# EAGLE schematic AGSE_Motor_Controller (EAGLE 6.5.0)
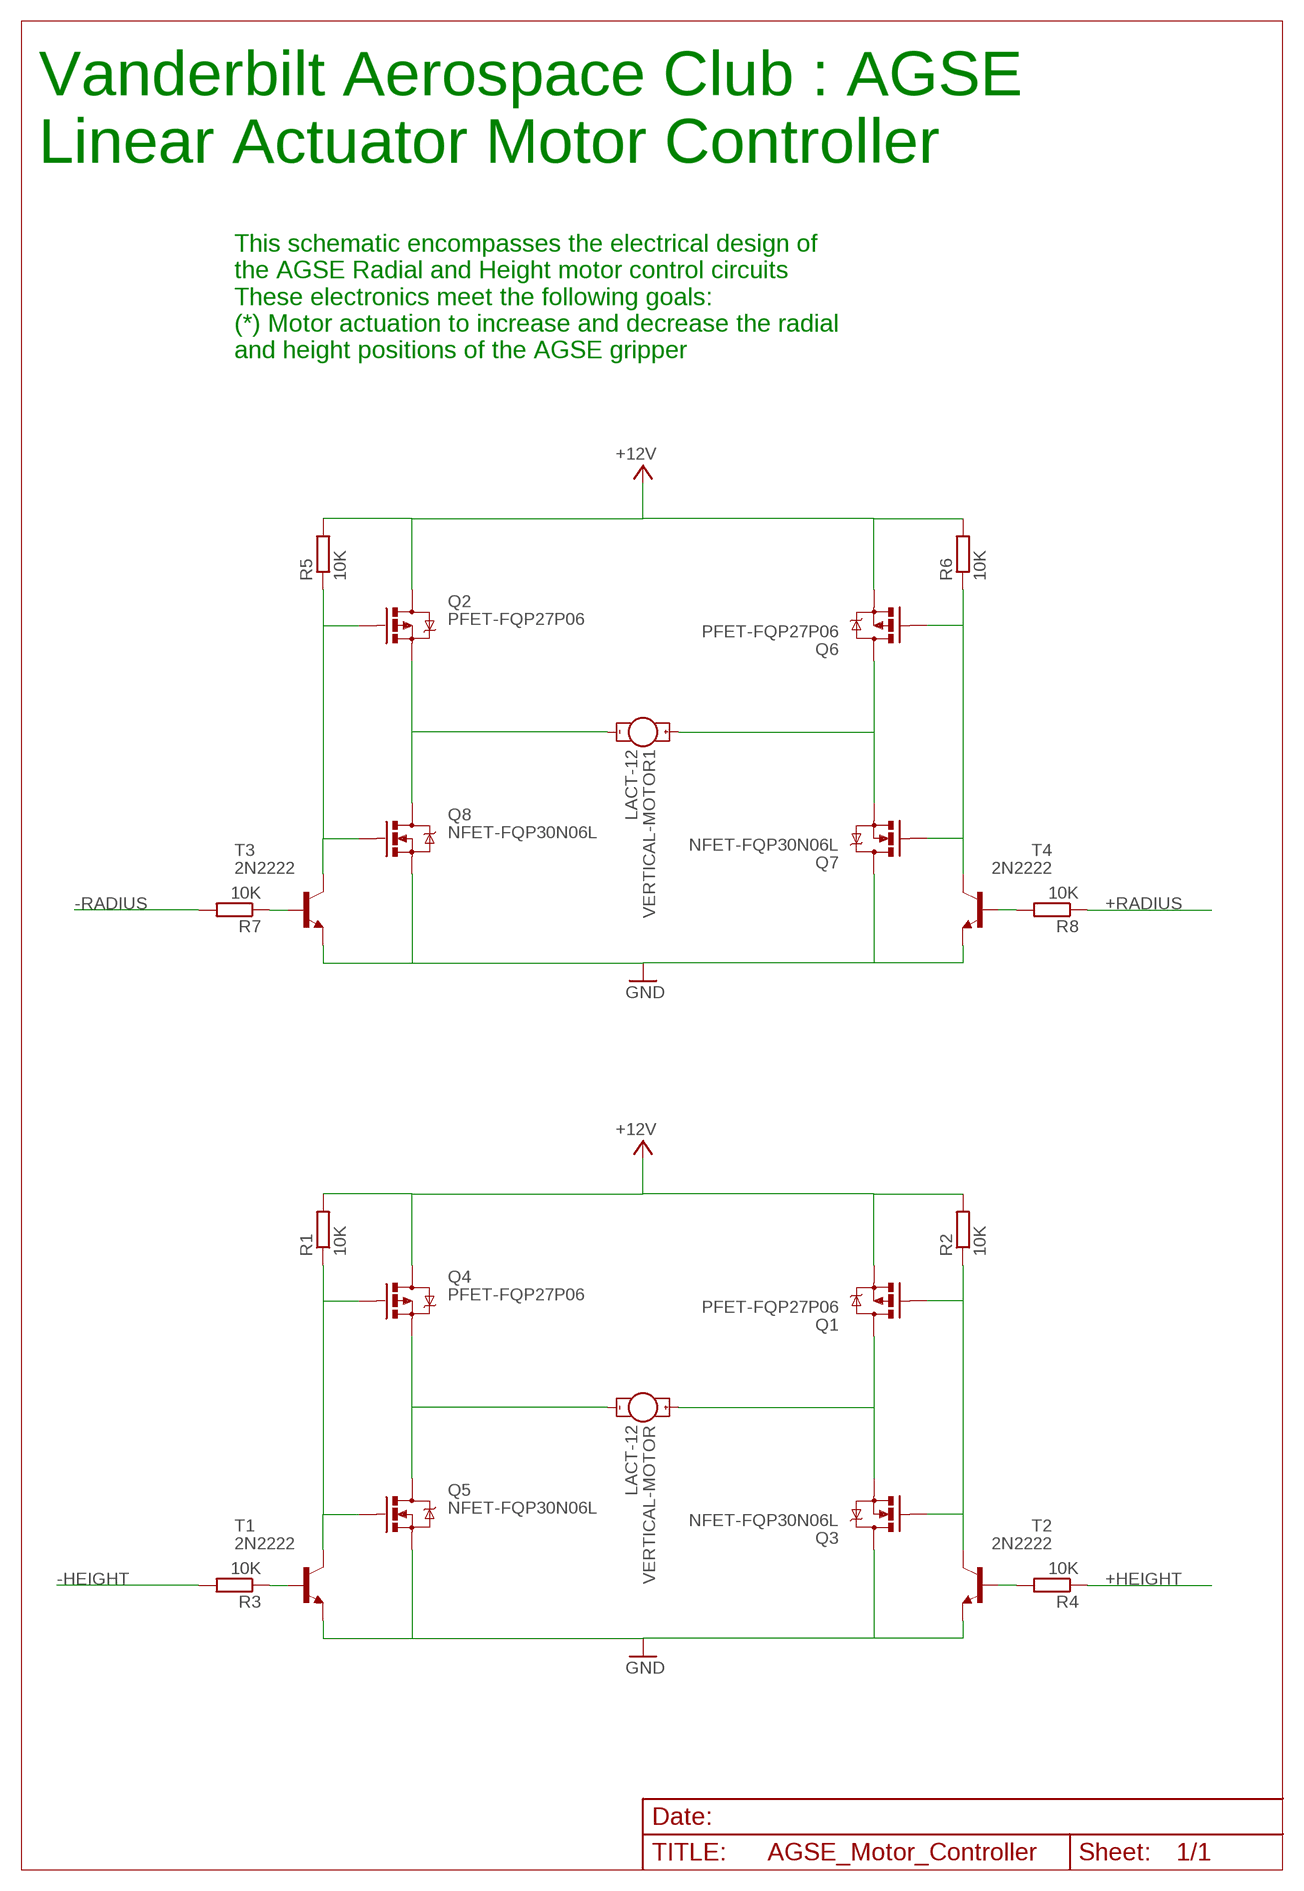
[diagram p0: schematic, sheet 1]

## Parts
Q1  PFET-FQP27P06  MOSFET-PCHANNELFQP27P06  [TO220V]
Q2  PFET-FQP27P06  MOSFET-PCHANNELFQP27P06  [TO220V]
Q3  NFET-FQP30N06L  MOSFET-NCHANNELFQP30N06L  [TO220V]
Q4  PFET-FQP27P06  MOSFET-PCHANNELFQP27P06  [TO220V]
Q5  NFET-FQP30N06L  MOSFET-NCHANNELFQP30N06L  [TO220V]
Q6  PFET-FQP27P06  MOSFET-PCHANNELFQP27P06  [TO220V]
Q7  NFET-FQP30N06L  MOSFET-NCHANNELFQP30N06L  [TO220V]
Q8  NFET-FQP30N06L  MOSFET-NCHANNELFQP30N06L  [TO220V]
R1  10K  R-EU_0207/12  [0207/12]
R2  10K  R-EU_0207/12  [0207/12]
R3  10K  R-EU_0207/12  [0207/12]
R4  10K  R-EU_0207/12  [0207/12]
R5  10K  R-EU_0207/12  [0207/12]
R6  10K  R-EU_0207/12  [0207/12]
R7  10K  R-EU_0207/12  [0207/12]
R8  10K  R-EU_0207/12  [0207/12]
T1  2N2222  [TO18]
T2  2N2222  [TO18]
T3  2N2222  [TO18]
T4  2N2222  [TO18]
VERTICAL-MOTOR  LACT-12  MOTOR10MM  [VIBE-MOTOR-10MM]
VERTICAL-MOTOR1  LACT-12  MOTOR10MM  [VIBE-MOTOR-10MM]

## Nets
+5V: Q1.3(S) Q2.2(D) Q4.2(D) Q6.3(S) R1.2 R2.2 R5.2 R6.2 ; supply symbol labelled +12V
+HEIGHT: R4.1
+RADIUS: R8.1
-HEIGHT: R3.2
-RADIUS: R7.2
GND: Q3.2(D) Q5.3(S) Q7.2(D) Q8.3(S) T1.1(E) T2.1(E) T3.1(E) T4.1(E)
N$1: Q4.3(S) Q5.2(D) VERTICAL-MOTOR.-
N$2: Q1.2(D) Q3.3(S) VERTICAL-MOTOR.+
N$3: Q4.1(G) Q5.1(G) R1.1 T1.3(C)
N$4: Q1.1(G) Q3.1(G) R2.1 T2.3(C)
N$5: R3.1 T1.2(B)
N$6: R4.2 T2.2(B)
N$7: Q6.2(D) Q7.3(S) VERTICAL-MOTOR1.+
N$8: Q2.3(S) Q8.2(D) VERTICAL-MOTOR1.-
N$9: Q2.1(G) Q8.1(G) R5.1 T3.3(C)
N$10: Q6.1(G) Q7.1(G) R6.1 T4.3(C)
N$11: R7.1 T3.2(B)
N$12: R8.2 T4.2(B)

## Notes on the sheet
- Vanderbilt Aerospace Club : AGSE
  Linear Actuator Motor Controller
- This schematic encompasses the electrical design of
  the AGSE Radial and Height motor control circuits  
  These electronics meet the following goals:
  (*) Motor actuation to increase and decrease the radial
  and height positions of the AGSE gripper

## Library data of the parts
Q1 Q2 Q4 Q6 = SparkFun-DiscreteSemi:MOSFET-PCHANNEL: Generic PMOSFET IRLML2244 - TRANS-11153 (SOT-23 -20V -4.3A) (1.Gate 2.Source 3.Drain) FQP27P06 - COM-10349 <http://www.sparkfun.com/products/10349> (TO-220 -60V -27A) (1.Gate 2.Source 3.Drain)
Q3 Q5 Q7 Q8 = SparkFun-DiscreteSemi:MOSFET-NCHANNEL: Common NMOSFET Parts MFG P/N Store ID Prod ID FDD8780 TRANS-09984 SI7820DN TRANS-11055 FDS6630A IC-08089 2N7002PW TRANS-11151 FQP30N06L COM-10213 TRANS-10060 BSS123LT1G TRANS-08345 BSS138 TRANS-00830 BS170 2N7000; PROD_ID: TRANS-10060
R1-R8 = resistor:R-EU_: RESISTOR, European symbol
T1-T4 = transistor:2N2222: NPN TRANSISTOR
VERTICAL-MOTOR VERTICAL-MOTOR1 = SparkFun-Electromechanical:MOTOR: Vibration Motor- ROB-08449 Physical dimension and wire connections for this powerful vibration motor. Motor has a self adhesive backing.

## Net classes
0 default: width 0.152 mm, drill 0.305 mm, clearance 0.152 mm